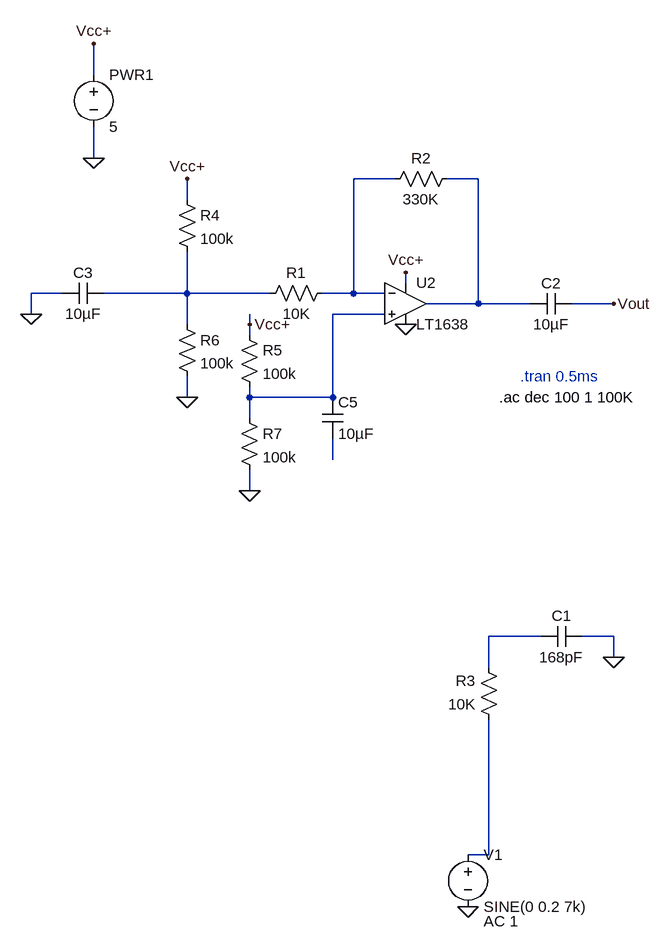
[diagram p0: schematic amplifer_with_LT1638.asc]
amplifer_with_LT1638.asc, the LTspice schematic file:
Version 4
SHEET 1 1232 1204
WIRE 128 -112 128 -160
WIRE 128 16 128 -32
WIRE 592 48 528 48
WIRE 720 48 672 48
WIRE 272 80 272 48
WIRE 608 208 608 192
WIRE 80 224 32 224
WIRE 272 224 272 160
WIRE 272 224 144 224
WIRE 400 224 272 224
WIRE 528 224 528 48
WIRE 528 224 480 224
WIRE 576 224 528 224
WIRE 720 240 720 48
WIRE 720 240 640 240
WIRE 800 240 720 240
WIRE 928 240 864 240
WIRE 32 256 32 224
WIRE 576 256 496 256
WIRE 272 272 272 224
WIRE 368 272 368 256
WIRE 368 288 368 272
WIRE 272 384 272 352
WIRE 368 384 368 368
WIRE 496 384 496 256
WIRE 496 384 368 384
WIRE 368 416 368 384
WIRE 496 480 496 448
WIRE 368 528 368 496
WIRE 816 752 736 752
WIRE 928 752 880 752
WIRE 928 784 928 752
WIRE 736 800 736 752
WIRE 736 1088 736 880
WIRE 736 1088 704 1088
FLAG 928 240 Vout
FLAG 272 48 Vcc+
FLAG 272 384 0
FLAG 32 256 0
FLAG 368 528 0
FLAG 368 272 Vcc+
FLAG 928 784 0
FLAG 704 1168 0
FLAG 128 -160 Vcc+
FLAG 128 16 0
FLAG 608 272 0
FLAG 608 192 Vcc+
SYMBOL Res 496 208 R90
WINDOW 0 0 56 VBottom 2
WINDOW 3 32 56 VTop 2
SYMATTR InstName R1
SYMATTR Value 10K
SYMBOL Res 688 32 R90
WINDOW 0 0 56 VBottom 2
WINDOW 3 32 56 VTop 2
SYMATTR InstName R2
SYMATTR Value 330K
SYMBOL Res 256 64 R0
SYMATTR InstName R4
SYMATTR Value 100k
SYMBOL Res 256 256 R0
SYMATTR InstName R6
SYMATTR Value 100k
SYMBOL Cap 144 208 R90
WINDOW 0 0 32 VBottom 2
WINDOW 3 32 32 VTop 2
SYMATTR InstName C3
SYMATTR Value 10µF
SYMBOL voltage 704 1072 R0
WINDOW 123 24 118 Left 2
SYMATTR Value2 AC 1
SYMATTR InstName V1
SYMATTR Value SINE(0 0.2 7k)
SYMBOL Res 752 896 R180
WINDOW 0 36 76 Left 2
WINDOW 3 36 40 Left 2
SYMATTR InstName R3
SYMATTR Value 10K
SYMBOL Cap 480 384 R0
SYMATTR InstName C5
SYMATTR Value 10µF
SYMBOL Res 352 272 R0
SYMATTR InstName R5
SYMATTR Value 100k
SYMBOL Res 352 400 R0
SYMATTR InstName R7
SYMATTR Value 100k
SYMBOL Cap 880 736 R90
WINDOW 0 0 32 VBottom 2
WINDOW 3 32 32 VTop 2
SYMATTR InstName C1
SYMATTR Value 168pF
SYMBOL Voltage 128 -128 R0
SYMATTR InstName PWR1
SYMATTR Value 5
SYMBOL OpAmps/LT1638 608 176 R0
SYMATTR InstName U2
SYMBOL Cap 864 224 R90
WINDOW 0 0 32 VBottom 2
WINDOW 3 32 32 VTop 2
SYMATTR InstName C2
SYMATTR Value 10µF
TEXT 784 352 Left 2 ;.tran 0.5ms
TEXT 752 384 Left 2 !.ac dec 100 1 100K

The netlist it stands for:
* amplifer_with_LT1638.asc
R1 N001 N003 10K
R2 N002 N001 330K
R4 Vcc+ N003 100k
R6 N003 0 100k
C3 N003 0 10µF
V1 N007 0 SINE(0 0.2 7k) AC 1
R3 N007 N006 10K
C5 N004 N005 10µF
R5 Vcc+ N004 100k
R7 N004 0 100k
C1 0 N006 168pF
V§PWR1 Vcc+ 0 5
XU2 N004 N001 Vcc+ 0 N002 LT1638  ; pins In+ In- V+ V- OUT
C2 Vout N002 10µF
* .tran 0.5ms
.ac dec 100 1 100K
.backanno
.end